# EAGLE design RS232 (EAGLE 9.6.2)
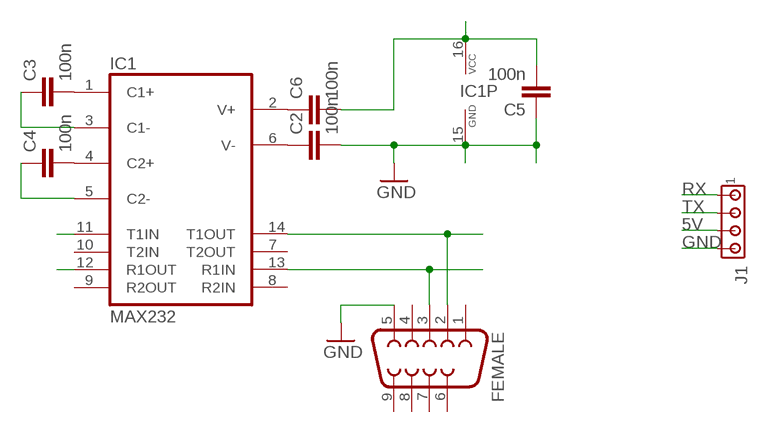
[diagram p0: schematic, sheet 1]

## Parts
C2  100n  C-EUC0805  [C0805]
C3  100n  C-EUC0805  [C0805]
C4  100n  C-EUC0805  [C0805]
C5  100n  C-EUC0805  [C0805]
C6  100n  C-EUC0805  [C0805]
FEMALE  F09H  [F09H]
IC1  MAX232  MAX232ECWES  [SO16]
J1  MTA04-156  [1X4MTA]

## Nets
5V: C5.2 C6.2 IC1.16(VCC) J1.3
GND: C2.2 C5.1 FEMALE.5 IC1.15(GND) J1.4
N$10: C3.2 IC1.1(C1+)
N$12: C4.2 IC1.4(C2+)
N$13: C3.1 IC1.3(C1-)
N$14: C4.1 IC1.5(C2-)
N$15: C6.1 IC1.2(V+)
N$16: C2.1 IC1.6(V-)
N$19: FEMALE.2 IC1.14(T1OUT)
N$20: FEMALE.3 IC1.13(R1IN)
RX: IC1.12(R1OUT) J1.1
TX: IC1.11(T1IN) J1.2
Unconnected: FEMALE.1 FEMALE.4 FEMALE.6 FEMALE.7 FEMALE.8 FEMALE.9 IC1.7(T2OUT) IC1.8(R2IN) IC1.9(R2OUT) IC1.10(T2IN)

## Library data of the parts
C2-C6 = rcl@1:C-EU: CAPACITOR, European symbol
FEMALE = con-subd:F09: SUB-D
IC1 = maxim-6b:MAX232ECWE: RS232 TRANSEIVER
J1 = con-amp:MTA04-156: AMP connector

## Board
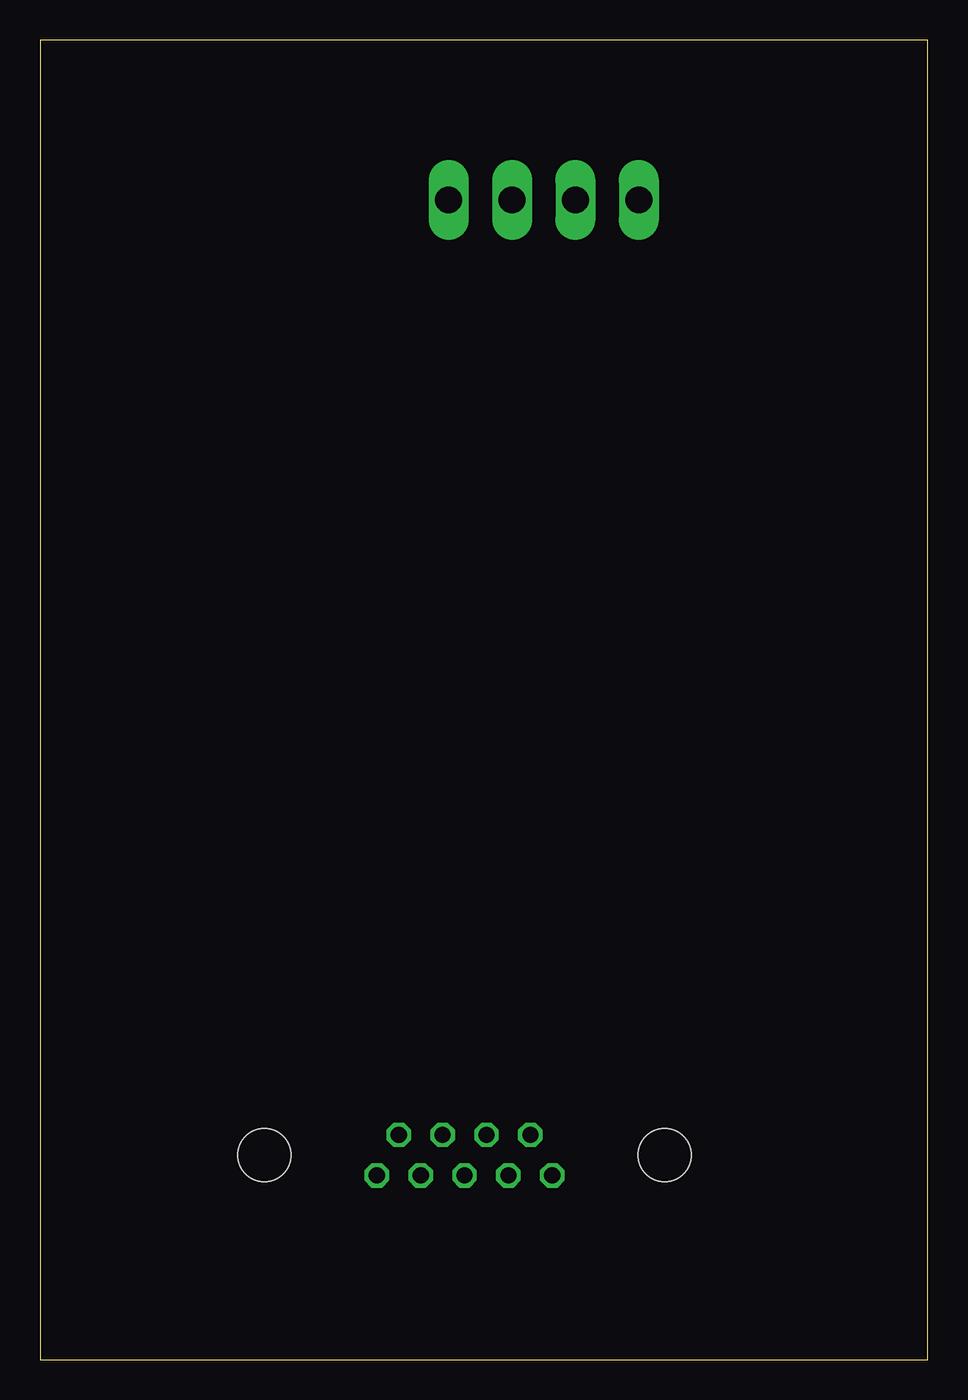
[diagram p1: board, top side]
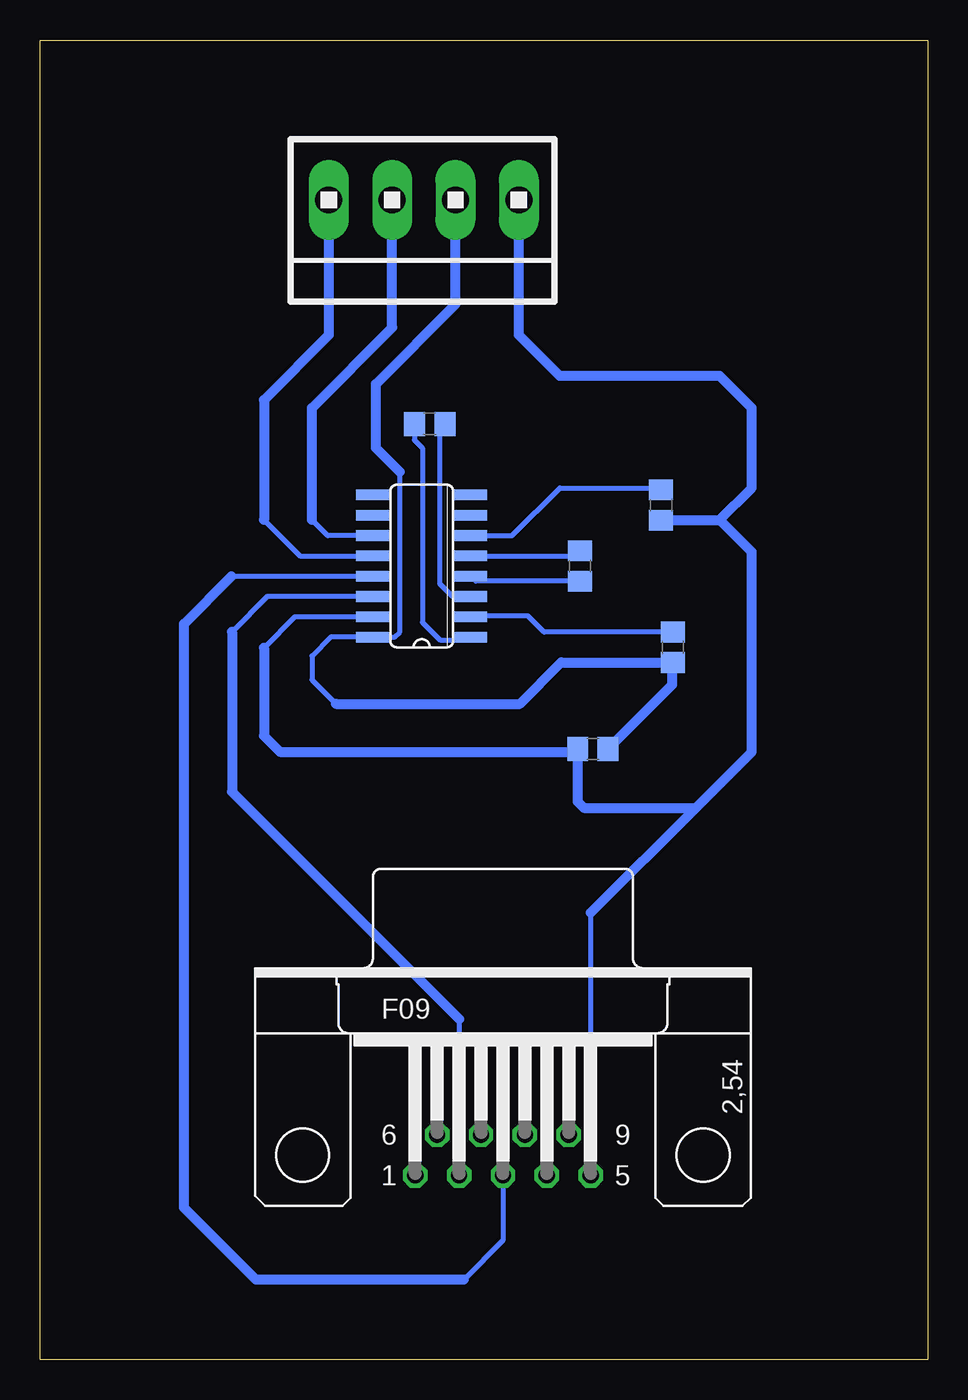
[diagram p2: board, bottom side, seen from below]

Size 55.5 x 82.5 mm. Coordinates in mm from the lower left corner, seen from the top.
Outline: 0,0 55.5,0 55.5,82.5 0,82.5 0,0
Copper layers (1*16): Top 0.035mm / dielectric 1.5mm / Bottom 0.035mm
Design rules "default": minimum track width 6mil, minimum drill 0.35mm, track to track 6mil, track to pad 6mil, pad to pad 6mil, via to via 6mil, smd to smd 6mil, copper to edge 40mil, drill to drill 6mil, minimum pad ring 10mil, minimum via ring 8mil, stop-mask expansion 4mil, vias tented up to drill 0mil, thermal gap 10mil

### Footprints (pad centres in the part's own frame; a part is rotated, then mirrored left to right if it is on the bottom)
C0805 = smd 1.3 x 1.5: 1 -0.95,0; 2 0.95,0
F09H = drill 1.016 octagon: 1 -5.486,-1.27; 2 -2.743,-1.27; 3 0,-1.27; 4 2.743,-1.27; 5 5.486,-1.27; 6 -4.115,1.27; 7 -1.372,1.27; 8 1.372,1.27; 9 4.115,1.27 | hole 3.302: -12.522,0; 12.522,0
SO16 = smd 0.66 x 2.032: 1 -4.445,-3.073; 2 -3.175,-3.073; 3 -1.905,-3.073; 4 -0.635,-3.073; 5 0.635,-3.073; 6 1.905,-3.073; 7 3.175,-3.073; 8 4.445,-3.073; 9 4.445,3.073; 10 3.175,3.073; 11 1.905,3.073; 12 0.635,3.073; 13 -0.635,3.073; 14 -1.905,3.073; 15 -3.175,3.073; 16 -4.445,3.073
1X4MTA = drill 1.676 long: 1 5.944,0; 2 1.981,0; 3 -1.981,0; 4 -5.944,0

### Placement (x,y rotation side)
C2  16.66,53.42 270 bottom
C3  31.13,58.5 180 bottom
C4  21.74,49.61 270 bottom
C5  20.93,38.18 0 bottom
C6  15.93,44.53 270 bottom
FEMALE  26.55,12.78 0 bottom
IC1  31.63,49.61 90 bottom
J1  31.5,72.5 180 bottom

### Tracks (layer width: path | path; a pad name or v marks a point on that pad's centre or on a via)
5V
  Bottom 0.152: C6.2 16,43.58 15.98,43.56
  Bottom 0.305: 37,41 38.5,42.5 38.5,44 37.34,45.16 IC1.16 33.34,45.16 33,45.5 33,55.5
  Bottom 0.61: 37,41 25.5,41 22.92,43.58 16,43.58 | 15.98,43.56 15.98,42.18 C5.2 | 33,55.5 34.5,57 34.5,61 29.52,65.98 J1.3
GND
  Bottom 0.152: 22.06,38 C5.1 | 13,52.5 16.63,52.5 C2.2
  Bottom 0.305: IC1.15 39.56,46.44 41.5,44.5 | 21.06,27.94 FEMALE.5
  Bottom 0.61: 41.5,44.5 41.5,39 40.5,38 22.06,38 | C5.1 21.88,34.88 21.5,34.5 14.5,34.5 | 14.5,34.5 11,38 11,50.5 13,52.5 | C2.2 13.03,52.47 11,54.5 11,59.5 13,61.5 23,61.5 25.56,64.06 J1.4 | 14.5,34.5 21.06,27.94
N$10
  Bottom 0.152: 28.72,45 IC1.1
  Bottom 0.305: C3.2 32.08,57.5 31.58,57 31.58,46.08 30.5,45 28.72,45
N$12
  Bottom 0.305: C4.2 28.24,48.66 IC1.4
N$13
  Bottom 0.152: 30.5,58.18 C3.1
  Bottom 0.305: IC1.3 29.7,47.7 30.5,48.5 30.5,58.18
N$14
  Bottom 0.152: 22.05,50.24 C4.1
  Bottom 0.305: IC1.5 22.05,50.24
N$15
  Bottom 0.152: 28.49,46.5 IC1.2
  Bottom 0.305: C6.1 23.98,45.48 25,46.5 28.49,46.5
N$16
  Bottom 0.152: 16.79,54.5 C2.1
  Bottom 0.305: IC1.6 25.98,51.52 23,54.5 16.79,54.5
N$19
  Bottom 0.305: IC1.14 41.3,47.7 43.5,45.5 | 29.29,21.29 FEMALE.2
  Bottom 0.61: 43.5,45.5 43.5,35.5 29.29,21.29
N$20
  Bottom 0.305: FEMALE.3 26.55,7.45 29,5 | 43.52,48.98 IC1.13
  Bottom 0.61: 29,5 42,5 46.5,9.5 46.5,46 43.52,48.98
RX
  Bottom 0.305: IC1.12 39.24,50.24 41.5,52.5
  Bottom 0.61: J1.1 37.44,64.06 41.5,60 41.5,52.5
TX
  Bottom 0.305: IC1.11 37.52,51.52 38.5,52.5
  Bottom 0.61: 38.5,52.5 38.5,59.5 33.48,64.52 J1.2